# EAGLE board uTTA_V2_Measure (EAGLE 6.3), part 1 of 2
VERSION: 2.00
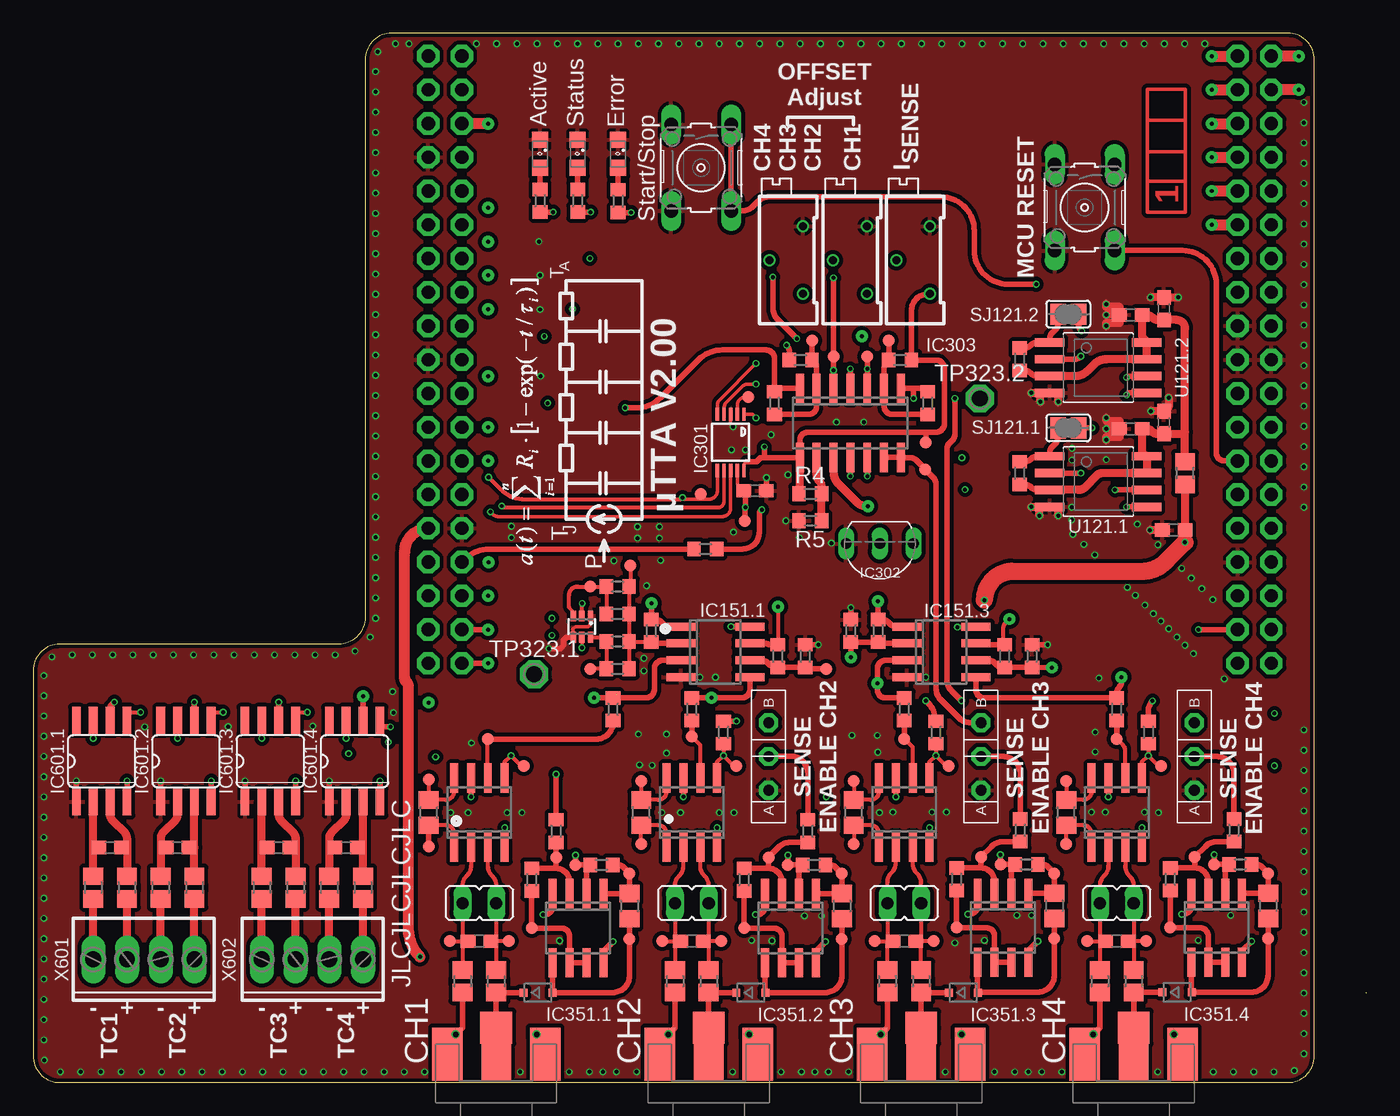
[diagram p5: board, top side]
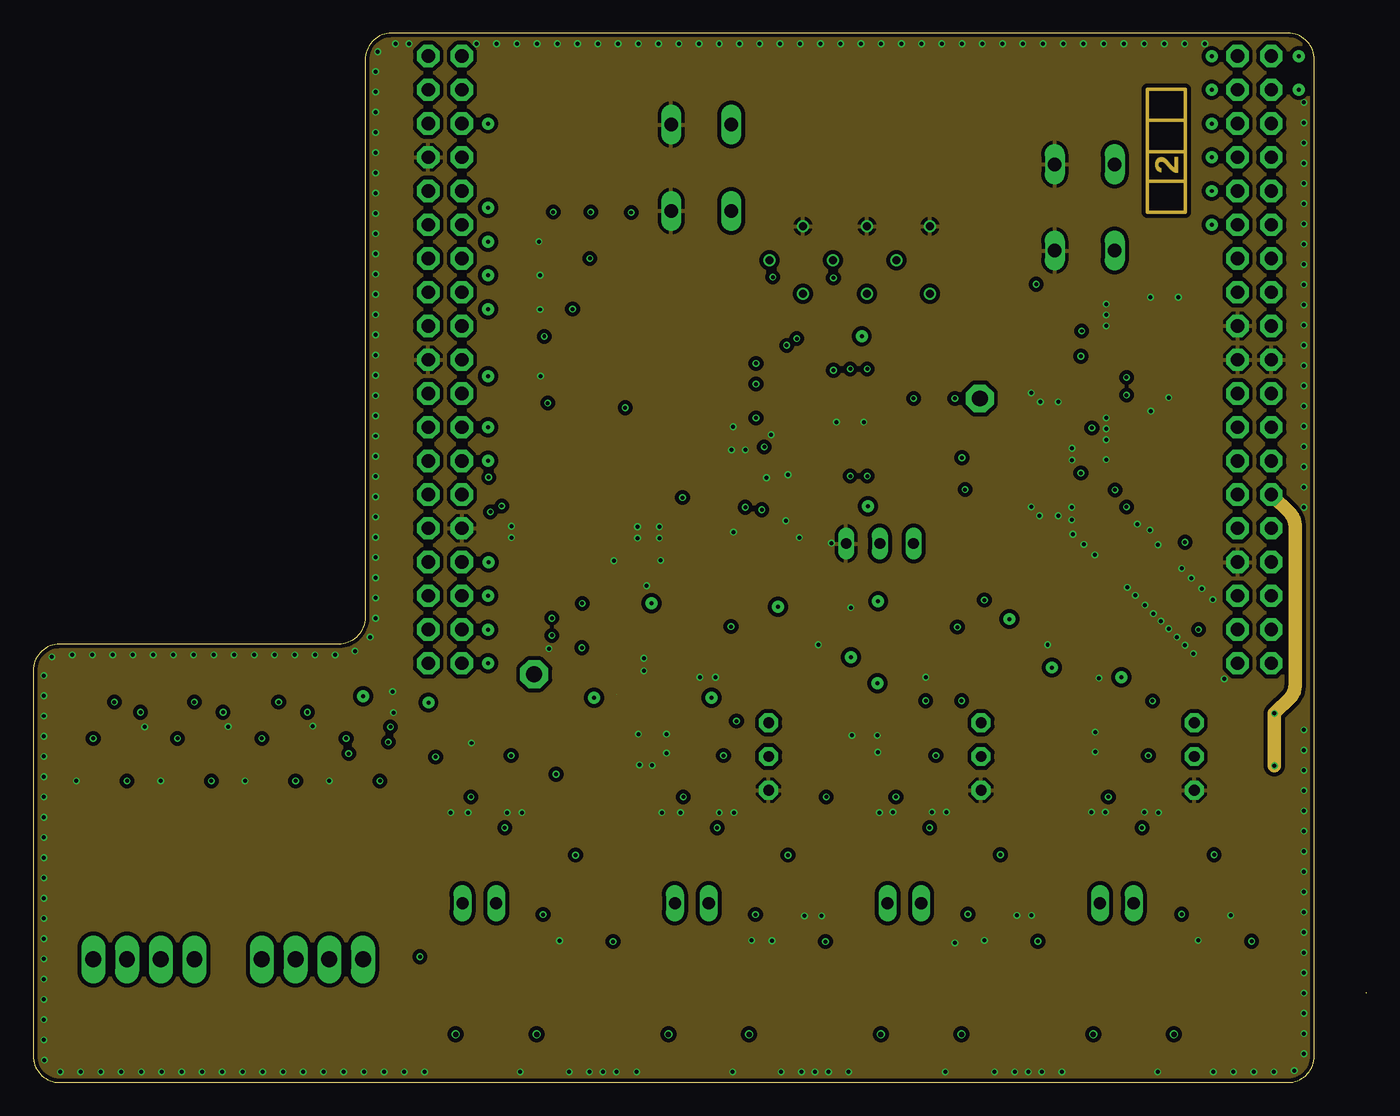
[diagram p6: board, inner layer Route2]
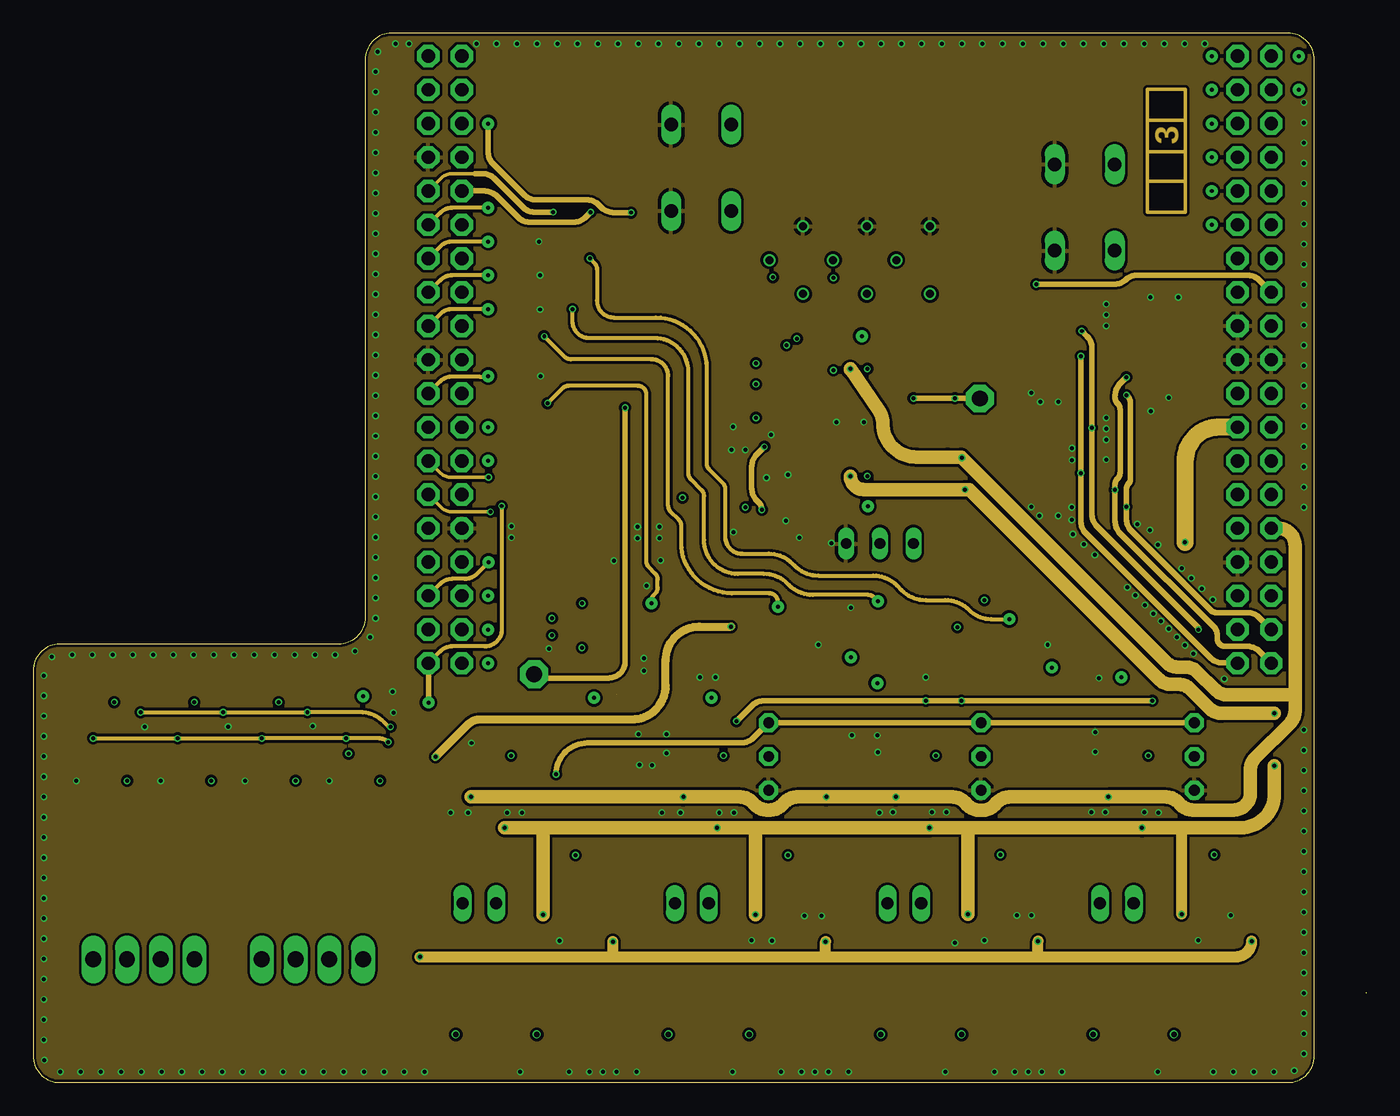
[diagram p7: board, inner layer Route15]
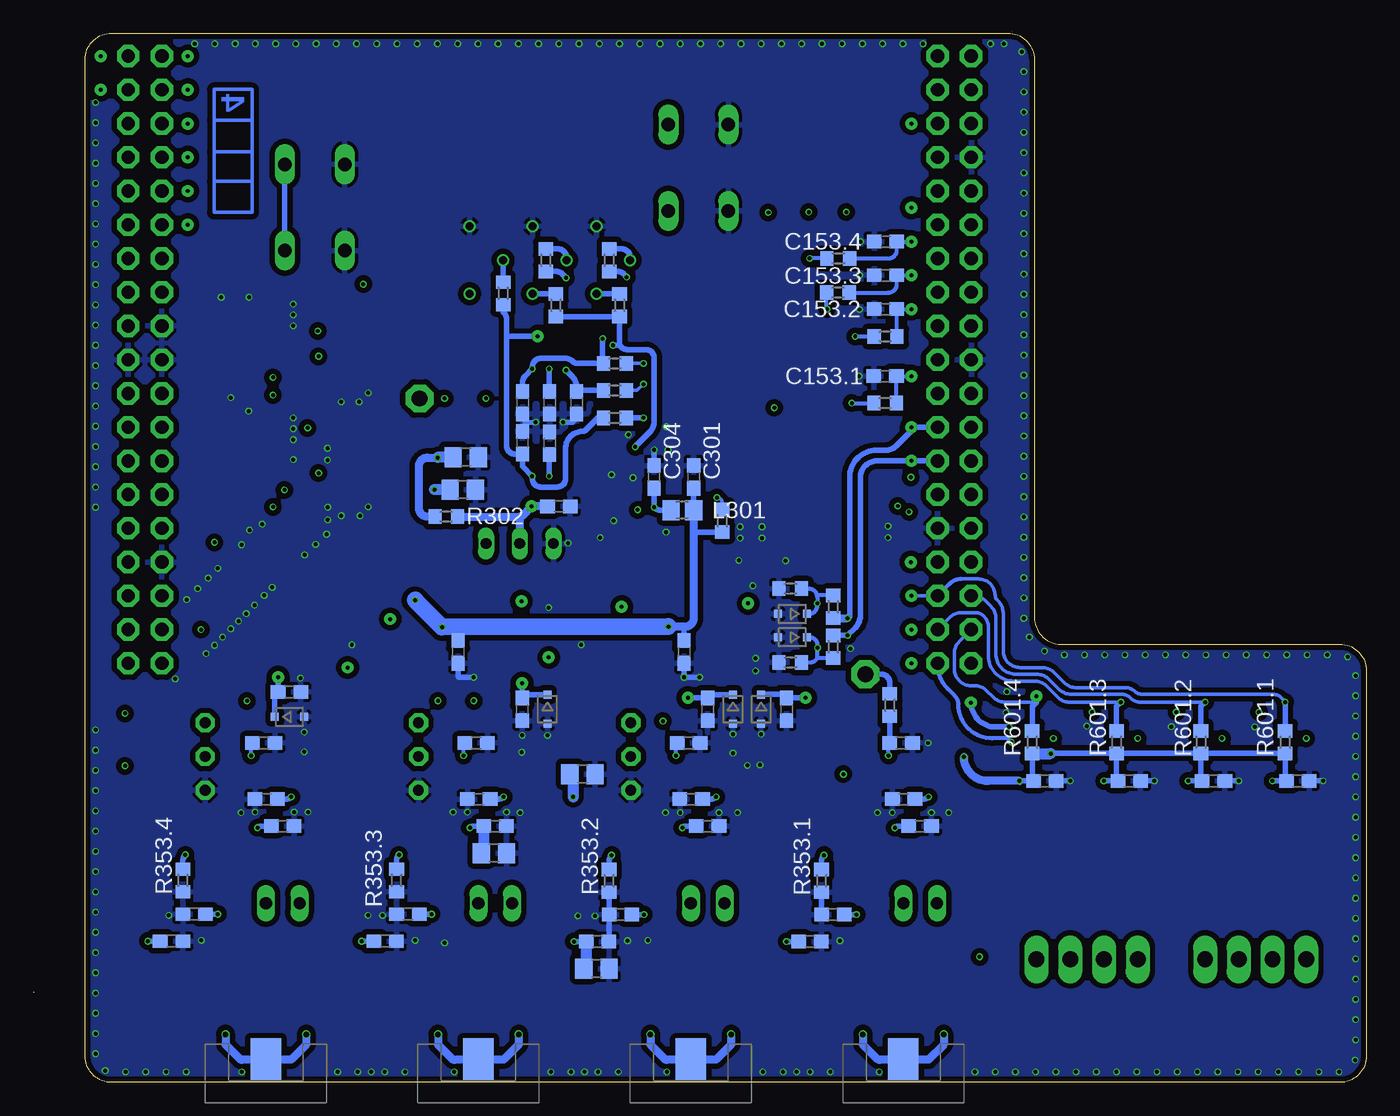
[diagram p8: board, bottom side, seen from below]

Size 100.41 x 79 mm. Coordinates in mm from the lower left corner, seen from the top.
Outline: 100.38,6.79 100.41,6.76
Outline: 0,31 0,2 arc90 2,0 94.5,0 arc90 96.5,2 96.5,77 arc90 94.5,79 27,79 arc90 25,77 25,35 arc-90 23,33 2,33 arc90 0,31
Copper layers (1*2*15*16): Top 0.035mm / dielectric 0.17mm / Route2 0.0175mm / dielectric 47mil / Route15 0.0175mm / dielectric 0.17mm / Bottom 0.035mm
Design rules "JLCPCB_4Layer": minimum track width 5mil, minimum drill 0.2mm, track to track 5mil, track to pad 0.2mm, pad to pad 5mil, via to via 5mil, smd to smd 0mil, copper to edge 0.2mm, drill to drill 0.5mm, minimum pad ring 4mil, minimum via ring 4mil, stop-mask expansion 3mil, vias tented up to drill 100mil, thermal gap 10mil
Net classes: 0 default: width 0.61 mm, drill 0.3 mm, clearance 0.2 mm; 1 Analog_Sig: width 0.25 mm, drill 0.3 mm, clearance 0.2 mm to class 0, clearance 0.2 mm; 2 Digital_Sig: width 0.25 mm, drill 0.3 mm, clearance 0.2 mm to class 0, clearance 0.3 mm to class 1, clearance 0.2 mm; 3 Power_>10V: width 0.4 mm, drill 0.3 mm, clearance 0.2 mm to class 0, clearance 0.25 mm to class 1, clearance 0.3 mm to class 2, clearance 0.2 mm; 4 Power_<10V: width 0.4 mm, drill 0.3 mm, clearance 0.2 mm to class 0, clearance 0.25 mm to class 1, clearance 0.3 mm to class 2, clearance 0.25 mm to class 3, clearance 0.2 mm; 5 SPI: width 0.25 mm, drill 0.3 mm, clearance 0.3 mm to class 0, clearance 0.4 mm to class 1, clearance 0.3 mm to class 2, clearance 0.4 mm to class 3, clearance 0.4 mm to class 4, clearance 0.25 mm; 6 High_Curr: width 3 mm, drill 0.3 mm, clearance 0.4 mm to class 0, clearance 0.4 mm to class 1, clearance 0.4 mm to class 2, clearance 0.4 mm to class 3, clearance 0.4 mm to class 4, clearance 0.4 mm to class 5, clearance 0.4 mm; 7 GND_ISO: width 0.4 mm, drill 0.3 mm, clearance 0.6 mm to class 0, clearance 0.6 mm to class 1, clearance 0.6 mm to class 2, clearance 0.6 mm to class 3, clearance 0.6 mm to class 4, clearance 0.6 mm to class 5, clearance 0.6 mm to class 6, clearance 0.3 mm; 8 PWR_ISO: width 0.3 mm, drill 0.3 mm, clearance 0.6 mm to class 0, clearance 0.6 mm to class 1, clearance 0.3 mm to class 2, clearance 0.6 mm to class 3, clearance 0.6 mm to class 4, clearance 0.6 mm to class 5, clearance 0.6 mm to class 6, clearance 0.3 mm to class 7, clearance 0.3 mm; 9 GND: width 0.3 mm, drill 0.3 mm, clearance 0.2 mm to class 0, clearance 0.2 mm to class 1, clearance 0.2 mm to class 2, clearance 0.3 mm to class 3, clearance 0.2 mm to class 4, clearance 0.25 mm to class 5, clearance 0.25 mm to class 6, clearance 0.4 mm to class 7, clearance 0.4 mm to class 8, clearance 0.2 mm; 10 USB: width 0.3 mm, drill 0.3 mm, clearance 0.4 mm to class 0, clearance 0.4 mm to class 1, clearance 0.4 mm to class 2, clearance 0.4 mm to class 3, clearance 0.4 mm to class 4, clearance 0.4 mm to class 5, clearance 0.4 mm to class 6, clearance 0.6 mm to class 7, clearance 0.6 mm to class 8, clearance 0.4 mm to class 9, clearance 0.4 mm

## Footprints (pad centres in the part's own frame; a part is rotated, then mirrored left to right if it is on the bottom)
C0805 = smd 1.3 x 1.5: 1 -0.95,0; 2 0.95,0
C0603 = smd 1.1 x 1: 1 -0.85,0; 2 0.85,0
SOD323-R = smd 0.6 x 0.6: A 1.1,0; C -1.1,0
SO08 = smd 0.6 x 2.2: 1 -1.905,-2.6; 2 -0.635,-2.6; 3 0.635,-2.6; 4 1.905,-2.6; 5 1.905,2.6; 6 0.635,2.6; 7 -0.635,2.6; 8 -1.905,2.6
MSOP10 = smd 0.25 x 1: 1 -1,-2.113; 2 -0.5,-2.113; 3 0,-2.113; 4 0.5,-2.113; 5 1,-2.113; 6 1,2.113; 7 0.5,2.113; 8 0,2.113; 9 -0.5,2.113; 10 -1,2.113
TO92- = drill 0.813 long: 1 2.54,0; 2 0,0; 3 -2.54,0
SO14 = smd 0.6 x 2.2: 1 -3.81,-2.6; 2 -2.54,-2.6; 3 -1.27,-2.6; 4 0,-2.6; 5 1.27,-2.6; 6 2.54,-2.6; 7 3.81,-2.6; 8 3.81,2.6; 9 2.54,2.6; 10 1.27,2.6; 11 0,2.6; 12 -1.27,2.6; 13 -2.54,2.6; 14 -3.81,2.6
SO08' = smd 0.66 x 2.032: 1 -1.905,-3.073; 2 -0.635,-3.073; 3 0.635,-3.073; 4 1.905,-3.073; 5 1.905,3.073; 6 0.635,3.073; 7 -0.635,3.073; 8 -1.905,3.073
JP1 = drill 0.914 long: 1 0,-1.27; 2 0,1.27
FB2012 = smd 1.3 x 1.5: 1 -0.85,0; 2 0.85,0
SML0805 = smd 1.2 x 1.2: A 1.05,0; C -1.05,0
R0603 = smd 1 x 1.1: 1 -0.85,0; 2 0.85,0
R0805 = smd 1.3 x 1.5: 1 -0.95,0; 2 0.95,0
RTRIM64Z = drill 0.61: A 0,-2.54; E 0,2.54; S -2.54,0
B3F-10XX = drill 1.016 long: 1 -3.251,2.261; 2 3.251,2.261; 3 -3.251,-2.261; 4 3.251,-2.261
SS_ESP101 = drill 0.8 pad 1.422 octagon: A 2.54,0; B -2.54,0; C 0,0
SJ = smd 1.168 x 1.6: 1 -0.762,0; 2 0.762,0
SOT363_PHILIPS = smd 0.4 x 0.8: 1 -0.65,-0.8; 2 0,-0.8; 3 0.65,-0.8; 4 0.65,0.8; 5 0,0.8; 6 -0.65,0.8
C90 = smd 0.9 x 0.9: P$1 0,0
C90H30 = drill 0.3 pad 0.9: P$1 0,0
P1-13 = drill 1.2 pad 2.1 octagon: 1 0,0
NUCLEO_BRD64_LOWER = drill 1 pad 1.676 octagon: L_3V3 5.79,33.02; L_5V 5.79,30.48; L_BOOT0 3.25,43.18; L_E5V 5.79,45.72; L_GND 5.79,43.18; L_GND3 3.25,27.94; L_GND4 5.79,25.4; L_GND5 5.79,27.94; L_IOREF 5.79,38.1; L_NC1 3.25,38.1; L_NC2 3.25,40.64; L_NC3 5.79,20.32; L_NC4 5.79,40.64; L_PA0 5.79,17.78; L_PA1 5.79,15.24; L_PA4 5.79,12.7; L_PA13 3.25,35.56; L_PA14 3.25,33.02; L_PA15 3.25,30.48; L_PB0 5.79,10.16; L_PB7 3.25,25.4; L_PC0 5.79,5.08; L_PC1 5.79,7.62; L_PC2 3.25,7.62; L_PC3 3.25,5.08; L_PC10 3.25,50.8; L_PC11 5.79,50.8; L_PC12 3.25,48.26; L_PC13 3.25,22.86; L_PC14 3.25,20.32; L_PC15 3.25,17.78; L_PD2 5.79,48.26; L_PF0 3.25,15.24; L_PF1 3.25,12.7; L_RESET 5.79,35.56; L_VBAT 3.25,10.16; L_VDD 3.25,45.72; L_VIN 5.79,22.86; R_AGND 66.75,12.7; R_AVDD 64.21,43.18; R_GND7 64.21,40.64; R_GND8 66.75,27.94; R_NC5 66.75,40.64; R_NC7 66.75,7.62; R_NC8 66.75,5.08; R_PA2 64.21,7.62; R_PA3 64.21,5.08; R_PA5 64.21,38.1; R_PA6 64.21,35.56; R_PA7 64.21,33.02; R_PA8 64.21,22.86; R_PA9 64.21,25.4; R_PA10 64.21,10.16; R_PA11 66.75,35.56; R_PA12 66.75,38.1; R_PB1 66.75,22.86; R_PB2 66.75,25.4; R_PB3 64.21,12.7; R_PB4 64.21,17.78; R_PB5 64.21,15.24; R_PB6 64.21,30.48; R_PB8 64.21,48.26; R_PB9 64.21,45.72; R_PB10 64.21,20.32; R_PB11 66.75,30.48; R_PB12 66.75,33.02; R_PB13 66.75,15.24; R_PB14 66.75,17.78; R_PB15 66.75,20.32; R_PC4 66.75,10.16; R_PC5 66.75,45.72; R_PC6 66.75,48.26; R_PC7 64.21,27.94; R_PC8 66.75,50.8; R_PC9 64.21,50.8; R_U5V 66.75,43.18
SO08W = smd 2.2 x 0.635: 1 -3.651,1.905; 2 -3.651,0.635; 3 -3.651,-0.635; 4 -3.651,-1.905; 5 3.651,-1.905; 6 3.651,-0.635; 7 3.651,0.635; 8 3.651,1.905
BU_SMA_3P = drill 0.4: @GND1 -3.493,-3.045; GND -3.493,3.045 | smd 4 x 2.3: @GND2 -2,-3.68; @GND3 -2,3.68 | smd 3.2 x 2.3 bottom: @GND4 -1.6,0 | smd 4 x 2.2: C1 -2,0 | smd 2.4 x 2.4: C2 -4,0
4POL254 = drill 1.2 long: 1 -3.81,0; 2 -1.27,0; 3 1.27,0; 4 3.81,0

## Placement (x,y rotation side)
C1  4.7u/25V  [C0805]  57.99,8.57 0 bottom
C2  4.7u/25V  [C0805]  68.06,44.64 180 bottom
C3  4.7u/25V  [C0805]  59.04,23.21 0 bottom
C4  4.7u/25V  [C0805]  65.71,17.27 180 bottom
C5  4.7u/25V  [C0805]  67.83,47.09 0 bottom
C102.1  1u/25V  [C0603]  34.84,21.34 180 bottom
C102.2  1u/25V  [C0603]  50.85,21.34 180 bottom
C102.3  1u/25V  [C0603]  66.85,21.34 180 bottom
C102.4  1u/25V  [C0603]  82.85,21.34 180 bottom
C104.1  1u/25V  [C0603]  33.61,19.3 180 bottom
C104.2  1u/25V  [C0603]  49.61,19.3 180 bottom
C104.3  1u/25V  [C0603]  65.61,19.3 180 bottom
C104.4  1u/25V  [C0603]  81.61,19.3 180 bottom
C105.1  10p  [C0603]  33.61,10.64 0 top
C105.2  10p  [C0603]  49.61,10.64 0 top
C105.3  10p  [C0603]  65.61,10.64 0 top
C105.4  10p  [C0603]  81.61,10.64 0 top
C106.1  330p  [C0603]  43.67,28.1 270 bottom
C106.2  330p  [C0603]  49.61,28.1 270 bottom
C106.3  330p  [C0603]  63.58,28.1 270 bottom
C106.4  330p  [C0603]  81.1,29.4 0 bottom
C107.1  100n/50V  [C0603]  35.03,25.56 0 bottom
C107.2  100n/50V  [C0603]  51.04,25.56 0 bottom
C107.3  100n/50V  [C0603]  67.04,25.56 0 bottom
C107.4  100n/50V  [C0603]  83.04,25.56 0 bottom
C121  100n/50V  [C0603]  85.9,41.59 180 top
C122.1  1u/25V  [C0603]  85.17,49.69 90 top
C122.2  1u/25V  [C0603]  85.17,58.26 90 top
C123.1  100n/50V  [C0603]  82.66,49.21 180 top
C123.2  100n/50V  [C0603]  82.66,57.78 180 top
C152.1  1u/25V  [C0603]  51.39,32.42 270 bottom
C152.3  1u/25V  [C0603]  68.4,32.42 270 bottom
C153.1  1n/25V  [C0603]  36.24,53.18 180 bottom
C153.2  2.2n/25V  [C0603]  36.21,58.23 180 bottom
C153.3  2.2n/25V  [C0603]  36.21,60.77 180 bottom
C153.4  2.2n/25V  [C0603]  36.21,63.31 180 bottom
C301  100n/50V  [C0603]  50.66,45.59 90 bottom
C302  1u/25V  [C0603]  61.51,51.18 270 bottom
C303  1u/25V  [C0603]  61.51,48.13 270 bottom
C304  1u/25V  [C0603]  53.64,45.59 90 bottom
C305  100n/50V  [C0603]  54.37,44.55 0 top
C306  100n/50V  [C0603]  60.82,43.37 0 bottom
C307  100n/50V  [C0603]  63.55,48.16 90 bottom
C321.1  100n/50V  [C0603]  59.48,51.18 270 bottom
C321.2  100n/50V  [C0603]  63.55,51.18 270 bottom
C351.1  1u/25V  [C0603]  41.89,10.6 0 bottom
C351.2  1u/25V  [C0603]  57.9,10.6 0 bottom
C351.3  1u/25V  [C0603]  73.9,10.64 0 bottom
C351.4  1u/25V  [C0603]  89.99,10.64 0 bottom
C352.1  1u/25V  [C0603]  40.18,12.64 0 bottom
C352.2  1u/25V  [C0603]  56.18,12.64 0 bottom
C352.3  1u/25V  [C0603]  72.18,12.67 0 bottom
C352.4  1u/25V  [C0603]  88.28,12.67 0 bottom
C601.1  100n/50V  [C0603]  5.16,22.7 0 bottom
C601.2  100n/50V  [C0603]  11.51,22.7 0 bottom
C601.3  100n/50V  [C0603]  17.86,22.7 0 bottom
C601.4  100n/50V  [C0603]  24.21,22.7 0 bottom
C602.1  10n/50V  [C0603]  5.79,17.68 180 top
C602.2  10n/50V  [C0603]  10.87,17.68 180 top
C602.3  10n/50V  [C0603]  18.49,17.68 180 top
C602.4  10n/50V  [C0603]  23.57,17.68 180 top
D101.1  SD101  [SOD323-R]  45.58,28.1 270 bottom
D101.2  SD101  [SOD323-R]  47.7,28.1 270 bottom
D101.3  SD101  [SOD323-R]  61.67,28.1 270 bottom
D101.4  SD101  [SOD323-R]  81.1,27.53 0 bottom
D151  MM3Z3V3T1GR  [SOD323-R]  43.23,33.53 180 bottom
D152  MM3Z3V3T1GR  [SOD323-R]  43.23,35.27 180 bottom
D351.1  SD101  [SOD323-R]  38.02,6.76 0 top
D351.2  SD101  [SOD323-R]  54.05,6.76 0 top
D351.3  SD101  [SOD323-R]  70.06,6.76 0 top
D351.4  SD101  [SOD323-R]  86.15,6.79 0 top
IC101.1  LT1167  [SO08]  33.61,20.32 0 top
IC101.2  LT1167  [SO08]  49.61,20.32 0 top
IC101.3  LT1167  [SO08]  65.61,20.32 0 top
IC101.4  LT1167  [SO08]  81.61,20.32 0 top
IC151.1  MCP602SN  [SO08]  51.39,32.42 270 top
IC151.3  MCP602SN  [SO08]  68.4,32.42 270 top
IC301  AD5664  [MSOP10]  52.53,48.2 180 top
IC302  LT1004CLP-2.5  [TO92-]  63.77,40.58 180 top
IC303  TL074D  [SO14]  61.55,49.66 180 top
IC351.1  AD8672ARZ  [SO08]  41.04,11.62 180 top
IC351.2  AD8672ARZ  [SO08]  57.04,11.62 180 top
IC351.3  AD8672ARZ  [SO08]  73.04,11.65 180 top
IC351.4  AD8672ARZ  [SO08]  89.14,11.65 180 top
IC601.1  MAX6675ISA  [SO08']  5.16,24.19 0 top
IC601.2  MAX6675ISA  [SO08']  11.51,24.19 0 top
IC601.3  MAX6675ISA  [SO08']  17.86,24.19 0 top
IC601.4  MAX6675ISA  [SO08']  24.21,24.19 0 top
JP101.1  [JP1]  33.61,13.49 270 top
JP101.2  [JP1]  49.61,13.49 270 top
JP101.3  [JP1]  65.61,13.49 270 top
JP101.4  [JP1]  81.61,13.49 270 top
L101.1  FBMMZ2012S  [FB2012]  32.34,7.62 270 top
L101.2  FBMMZ2012S  [FB2012]  48.34,7.62 270 top
L101.3  FBMMZ2012S  [FB2012]  64.34,7.62 270 top
L101.4  FBMMZ2012S  [FB2012]  80.34,7.62 270 top
L102.1  FBMMZ2012S  [FB2012]  34.88,7.62 270 top
L102.2  FBMMZ2012S  [FB2012]  50.88,7.62 270 top
L102.3  FBMMZ2012S  [FB2012]  66.88,7.62 270 top
L102.4  FBMMZ2012S  [FB2012]  82.88,7.62 270 top
L121  FBMMZ2012S  [FB2012]  86.76,45.88 90 top
L301  FBMMZ2012S  [FB2012]  51.51,43.08 180 bottom
L601.1  FBMMZ2012S  [FB2012]  7.06,14.67 270 top
L601.2  FBMMZ2012S  [FB2012]  12.14,14.67 270 top
L601.3  FBMMZ2012S  [FB2012]  19.76,14.67 270 top
L601.4  FBMMZ2012S  [FB2012]  24.84,14.67 270 top
L602.1  FBMMZ2012S  [FB2012]  4.52,14.67 270 top
L602.2  FBMMZ2012S  [FB2012]  9.6,14.67 270 top
L602.3  FBMMZ2012S  [FB2012]  17.22,14.67 270 top
L602.4  FBMMZ2012S  [FB2012]  22.3,14.67 270 top
LED1  GREEN  [SML0805]  44.05,69.91 270 top
LED2  RED  [SML0805]  38.18,69.91 270 top
LED3  GREEN  [SML0805]  41,69.91 270 top
R1  680  [R0603]  44.05,66.36 90 top
R2  680  [R0603]  38.18,66.39 90 top
R3  680  [R0603]  41,66.39 90 top
R4  0R  [R0603]  58.53,44.32 0 top
R5  DNP  [R0603]  58.53,42.29 180 top
R101.1  49k9  [R0805]  29.8,20.32 90 top
R101.2  49k9  [R0805]  45.8,20.32 90 top
R101.3  49k9  [R0805]  61.8,20.32 90 top
R101.4  49k9  [R0805]  77.8,20.32 90 top
R102.1  1k  [R0603]  43.67,28.1 270 top
R102.2  1k  [R0603]  49.61,28.1 270 top
R102.3  1k  [R0603]  65.61,28.1 270 top
R102.4  1k  [R0603]  81.61,28.1 270 top
R103.1  10R  [R0603]  35.89,28.42 270 bottom
R103.2  10R  [R0603]  51.99,26.35 270 top
R103.3  10R  [R0603]  67.99,26.35 270 top
R103.4  10R  [R0603]  83.99,26.35 270 top
R121.1  10k  [R0603]  74.31,45.88 90 top
R121.2  10k  [R0603]  74.31,54.45 90 top
R151.1  24k9  [R0603]  46.56,34 90 top
R151.2  24k9  [R0603]  56.09,32.1 90 top
R151.3  24k9  [R0603]  63.64,34 90 top
R151.4  24k9  [R0603]  73.17,32.1 90 top
R152.2  10k  [R0603]  58.15,32.1 270 top
R152.3  10k  [R0603]  61.58,34 270 top
R152.4  10k  [R0603]  75.23,32.1 270 top
R153.1  330R  [R0603]  36.24,51.15 180 bottom
R153.2  1k2  [R0603]  36.21,56.17 180 bottom
R153.3  1k2  [R0603]  39.8,59.47 180 bottom
R153.4  1k2  [R0603]  39.77,62.04 180 bottom
R154A  100k  [R0603]  44.02,37.34 0 top
R154B  100k  [R0603]  44.02,35.27 0 top
R155A  15K  [R0603]  44.02,33.21 0 top
R156B  DNP  [R0603]  44.02,31.15 0 top
R157  4k7  [R0603]  40.15,35.81 90 bottom
R158  100k  [R0603]  43.39,37.18 0 bottom
R159  4k7  [R0603]  40.15,32.8 270 bottom
R160  100k  [R0603]  43.39,31.62 0 bottom
R301  10k  [R0603]  48.5,42.29 90 bottom
R302  1k  [R0603]  69.29,42.61 0 bottom
R303  1k  [R0603]  56.59,50.04 180 bottom
R304  10k  [RTRIM64Z]  67.55,61.91 0 top
R305  1k  [R0603]  65.01,59.4 270 bottom
R306  DNP  [R0603]  50.62,40.16 180 top
R321.1  10k  [R0603]  57.8,54.39 180 top
R321.2  10k  [R0603]  65.29,54.39 0 top
R322.1  1k  [R0603]  56.59,52.1 180 bottom
R322.2  1k  [R0603]  56.59,54.13 180 bottom
R323.1  6k8  [R0603]  61.04,58.52 270 bottom
R323.2  6k8  [R0603]  56.24,58.52 270 bottom
R324.1  1k  [RTRIM64Z]  62.78,61.91 0 top
R324.2  1k  [RTRIM64Z]  57.99,61.91 0 top
R325.1  1k  [R0603]  61.8,61.91 270 bottom
R325.2  1k  [R0603]  57.01,61.91 270 bottom
R326.1  4k99  [R0603]  55.83,51.15 270 top
R326.2  4k99  [R0603]  67.36,51.15 270 top
R351.1  10k  [R0603]  39.38,18.92 270 top
R351.2  10k  [R0603]  58.34,18.92 270 top
R351.3  10k  [R0603]  74.34,18.99 270 top
R351.4  10k  [R0603]  90.44,18.99 270 top
R352.1  1k  [R0603]  37.54,15.27 270 top
R352.2  1k  [R0603]  53.55,15.27 270 top
R352.3  1k  [R0603]  69.55,15.3 270 top
R352.4  1k  [R0603]  85.64,15.3 270 top
R353.1  10k  [R0603]  41.04,15.18 90 bottom
R353.2  10k  [R0603]  57.04,15.18 90 bottom
R353.3  10k  [R0603]  73.04,15.21 90 bottom
R353.4  10k  [R0603]  89.14,15.21 90 bottom
R354.1  1k  [R0603]  42.81,16.38 0 top
R354.2  1k  [R0603]  58.82,16.38 0 top
R354.3  1k  [R0603]  74.82,16.41 0 top
R354.4  1k  [R0603]  90.92,16.41 0 top
R355.1  22R  [R0805]  44.91,13.27 270 top
R355.2  22R  [R0805]  60.91,13.27 270 top
R355.3  22R  [R0805]  76.91,13.3 270 top
R355.4  22R  [R0805]  93.01,13.3 270 top
R601.1  10k  [R0603]  6.11,25.62 90 bottom
R601.2  10k  [R0603]  12.46,25.62 90 bottom
R601.3  10k  [R0603]  18.81,25.62 90 bottom
R601.4  10k  [R0603]  25.16,25.62 90 bottom
S1  [B3F-10XX]  50.31,68.87 270 top
S11  [B3F-10XX]  79.2,65.88 270 top
S351.2  SS_ESP101  [SS_ESP101]  55.39,24.54 270 top
S351.3  SS_ESP101  [SS_ESP101]  71.39,24.54 270 top
S351.4  SS_ESP101  [SS_ESP101]  87.45,24.54 270 top
SJ121.1  [SJ]  77.96,49.28 180 top
SJ121.2  [SJ]  77.96,57.85 180 top
T151  BSS138PS  [SOT363_PHILIPS]  41.32,34.32 180 top
TP1  TPC90  [C90]  53.86,51.63 0 top
TP3  TPC90H30  [C90H30]  95.33,77.28 0 top
TP4  TPC90H30  [C90H30]  95.33,74.74 0 top
TP5  TPC90H30  [C90H30]  88.76,74.74 0 top
TP6  TPC90H30  [C90H30]  88.76,77.28 0 top
TP7  TPC90H30  [C90H30]  88.76,72.2 0 top
TP8  TPC90H30  [C90H30]  88.76,69.66 0 top
TP9  TPC90H30  [C90H30]  88.76,67.12 0 top
TP10  TPC90H30  [C90H30]  88.76,64.58 0 top
TP11  TPC90H30  [C90H30]  34.27,72.2 0 top
TP12  TPC90H30  [C90H30]  34.27,65.85 0 top
TP17  TPC90H30  [C90H30]  34.27,49.34 0 top
TP18  TPC90H30  [C90H30]  34.27,46.8 0 top
TP19  TPC90H30  [C90H30]  34.27,31.56 0 top
TP20  TPC90H30  [C90H30]  34.27,34.1 0 top
TP21  TPC90H30  [C90H30]  34.27,36.64 0 top
TP22  TPC90H30  [C90H30]  29.76,28.61 0 top
TP23  TPC90H30  [C90H30]  24.84,29.08 0 top
TP24  TPC90H30  [C90H30]  34.3,39.18 0 top
TP101.1  TPC90  [C90]  31.38,10.64 180 top
TP101.2  TPC90  [C90]  47.39,10.64 180 top
TP101.3  TPC90  [C90]  63.39,10.64 90 top
TP101.4  TPC90  [C90]  79.39,10.64 180 top
TP102.1  TPC90  [C90]  35.83,10.64 0 top
TP102.2  TPC90  [C90]  51.83,10.64 0 top
TP102.3  TPC90  [C90]  67.83,10.64 90 top
TP102.4  TPC90  [C90]  83.83,10.64 180 top
TP103.1  TPC90  [C90]  29.8,17.78 180 top
TP103.2  TPC90  [C90]  45.8,17.94 180 top
TP103.3  TPC90  [C90]  61.8,17.94 90 top
TP103.4  TPC90  [C90]  77.8,17.94 90 top
TP104.1  TPC90  [C90]  29.8,22.83 180 top
TP104.2  TPC90  [C90]  45.8,22.7 180 top
TP104.3  TPC90  [C90]  61.8,22.7 90 top
TP104.4  TPC90  [C90]  77.8,22.7 90 top
TP105.1  TPC90  [C90]  34.24,25.84 180 top
TP105.2  TPC90  [C90]  49.61,26.04 90 top
TP105.3  TPC90  [C90]  65.61,25.88 90 top
TP105.4  TPC90  [C90]  81.61,25.88 90 top
TP106.1  TPC90H30  [C90H30]  42.24,28.96 180 top
TP106.2  TPC90H30  [C90H30]  51.1,28.96 0 top
TP106.3  TPC90H30  [C90H30]  63.58,30.07 0 top
TP106.4  TPC90H30  [C90H30]  81.96,30.51 0 top
TP107.1  TPC90  [C90]  36.94,23.81 0 top
TP107.2  TPC90  [C90]  52.94,23.81 90 top
TP107.3  TPC90  [C90]  68.94,23.81 90 top
TP107.4  TPC90  [C90]  84.95,23.81 90 top
TP151.1  TPC90H30  [C90H30]  46.56,36.07 90 top
TP151.2  TPC90H30  [C90H30]  56.09,35.81 90 top
TP151.3  TPC90H30  [C90H30]  63.64,36.23 90 top
TP151.4  TPC90H30  [C90H30]  73.52,34.89 90 top
TP152.1  TPC90  [C90]  44.97,38.93 90 top
TP152.2  TPC90  [C90]  59.74,31.15 90 top
TP152.3  TPC90H30  [C90H30]  61.58,32 0 top
TP152.4  TPC90H30  [C90H30]  76.72,31.24 90 top
TP153  TPC90  [C90]  41.96,37.34 180 top
TP153.1  TPC90H30  [C90H30]  34.27,53.18 0 top
TP153.2  TPC90H30  [C90H30]  34.27,58.23 0 top
TP153.3  TPC90H30  [C90H30]  34.27,60.77 180 top
TP153.4  TPC90H30  [C90H30]  34.27,63.31 0 top
TP154  TPC90  [C90]  41.96,31.15 180 top
TP301  TPC90  [C90]  53.61,42.26 0 top
TP302  TPC90  [C90]  50.27,44.29 180 top
TP303  TPC90H30  [C90H30]  62.88,43.37 180 top
TP304  TPC90  [C90]  67.23,48.2 0 top
TP305  TPC90H30  [C90H30]  62.4,56.2 180 top
TP306  TPC90  [C90]  67.17,46.16 180 top
TP321.1  TPC90  [C90]  60.28,54.67 0 top
TP321.2  TPC90  [C90]  62.82,54.64 180 top
TP322.1  TPC90  [C90]  58.66,55.88 0 top
TP322.2  TPC90  [C90]  64.44,55.88 180 top
TP323.1  TPO210H120  [P1-13]  37.73,30.73 0 top
TP323.2  TPO210H120  [P1-13]  71.29,51.5 0 top
TP351.1  TPC90  [C90]  39.38,16.95 0 top
TP351.2  TPC90  [C90]  55.39,16.95 180 top
TP351.3  TPC90  [C90]  71.39,16.99 180 top
TP351.4  TPC90  [C90]  87.49,16.99 180 top
TP352.1  TPC90  [C90]  40.85,16.38 0 top
TP352.2  TPC90  [C90]  56.85,16.38 180 top
TP352.3  TPC90  [C90]  72.85,16.41 180 top
TP352.4  TPC90  [C90]  88.95,16.41 180 top
TP353.1  TPC90  [C90]  37.54,11.62 0 top
TP353.2  TPC90  [C90]  53.55,11.62 180 top
TP353.3  TPC90  [C90]  69.55,11.65 180 top
TP353.4  TPC90  [C90]  85.64,11.65 180 top
TP354.2  TPC90  [C90]  60.91,15.72 180 top
TP354.3  TPC90  [C90]  76.91,15.75 180 top
TP354.4  TPC90  [C90]  93.01,15.75 180 top
TP355.1  TPC90  [C90]  44.91,10.79 0 top
TP355.2  TPC90  [C90]  60.91,10.79 180 top
TP355.3  TPC90  [C90]  76.91,10.83 180 top
TP355.4  TPC90  [C90]  93.01,10.83 180 top
TP9354.1  TPC90  [C90]  44.91,15.75 0 top
U11  NUCLEO_F103_BOT  [NUCLEO_BRD64_LOWER]  96.5,82.36 180 top
U121.1  W25Q128JV  [SO08W]  80.22,45.24 0 top
U121.2  W25Q128JV  [SO08W]  80.22,53.82 0 top
U$1  [A4_LOC_CC_BY_NC_SA]  -72.09,-47.75 0 top  (outside the outline)
X101.1  BU-SMA-GSPECIAL  [BU_SMA_3P]  34.88,0.13 270 top
X101.2  BU-SMA-GSPECIAL  [BU_SMA_3P]  50.88,0.13 270 top
X101.3  BU-SMA-GSPECIAL  [BU_SMA_3P]  66.88,0.13 270 top
X101.4  BU-SMA-GSPECIAL  [BU_SMA_3P]  82.88,0.13 270 top
X601  [4POL254]  8.33,9.27 180 top
X602  [4POL254]  21.03,9.27 180 top